# Altium project SC2.0.PrjPCB
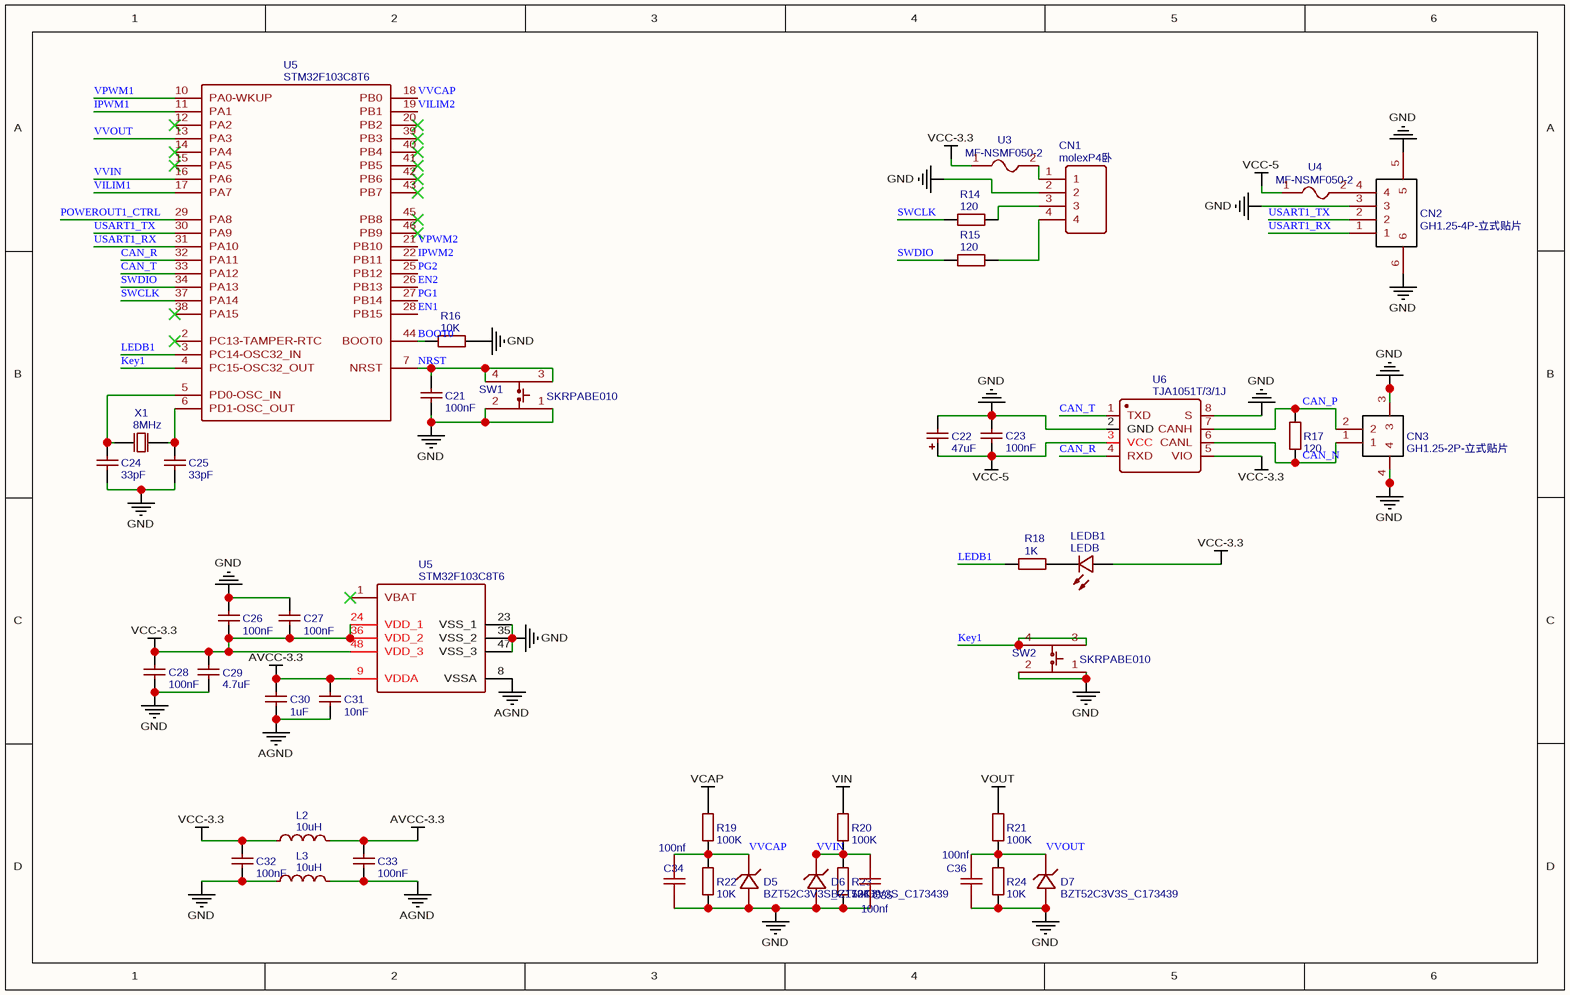
[diagram p0: MCU copy.SchDoc]
4 sheets, 184 parts. Net scope: flat (ports and power ports of the same name join across sheets).
Board file: SCapacitor2.0_2020-03-19_00-03-24.pcbdoc
Sheets:
  MCU copy.SchDoc
  power copy.SchDoc
  Switch1 copy.SchDoc
  Switch2 copy.SchDoc

## Sheet MCU copy.SchDoc
size 293 x 185 mm

### Parts
(Parts that share a designator on the sheet are numbered #1, #2 ... from top to bottom, then left to right.)
C21  100nF  [C0603]
C22  47uF  [CASE-A_3216]
C23  100nF  [R0603]
C24  33pF  [C0603]
C25  33pF  [C0603]
C26  100nF  [C0603]
C27  100nF  [C0603]
C28  100nF  [C0603]
C29  4.7uF  [C0603]
C30  1uF  [C0603]
C31  10nF  [C0603]
C32  100nF  [C0603]
C33  100nF  [C0603]
C34  100nf  [C0603]
C35  100nf  [C0603]
C36  100nf  [C0603]
CN1  molexP4卧  [SMD-10.15X4.8-4P]
CN2  GH1.25-4P-立式贴片  [SMD-1.25MM-4P-JST-H4.05]
CN3  GH1.25-2P-立式贴片  [SMD-1.25MM-2P-JST-H4.05]
D5  BZT52C3V3S_C173439  [SOD-323_L1.8-W1.3-LS2.5-RD]
D6  BZT52C3V3S_C173439  [SOD-323_L1.8-W1.3-LS2.5-RD]
D7  BZT52C3V3S_C173439  [SOD-323_L1.8-W1.3-LS2.5-RD]
L2  10uH  [L0603]
L3  10uH  [L0603]
LEDB1  LEDB  [LED-0603]
R14  120  [R0402]
R15  120  [R0402]
R16  10K  [R0402]
R17  120  [R0402]
R18  1K  [R0603]
R19  100K  [R0402]
R20  100K  [R0402]
R21  100K  [R0402]
R22  10K  [R0402]
R23  10K  [R0402]
R24  10K  [R0402]
SW1  SKRPABE010  [KEY-SMD-4P_L4.2-W3.2-H2.5]
SW2  SKRPABE010  [KEY-SMD-4P_L4.2-W3.2-H2.5]
U3  MF-NSMF050-2  [FUSE-1206]
U4  MF-NSMF050-2  [FUSE-1206]
U5#1  STM32F103C8T6  [LQFP-48_7X7X05P]
U5#2  STM32F103C8T6  [LQFP-48_7X7X05P]
U6  TJA1051T/3/1J  [SOIC-8_150MIL]
X1  8MHz  [SMD-5032_2P]

### Nets
AGND: C21.1 C22.2 C23.2 C24.1 C25.1 C26.1 C27.2 C28.1 C29.1 C30.1 C31.1 C32.1 C33.1 C34.1 C35.1 C36.1 CN1.2 CN2.3 CN2.5 CN2.6 CN3.3 CN3.4 D5.2 D6.2 D7.2 L3.1 L3.2 R16.1 R22.1 R23.1 R24.1 SW1.1 SW1.2 SW2.1 SW2.2 U5#2.8(VSSA) U5#2.23(VSS_1) U5#2.35(VSS_2) U5#2.47(VSS_3) U6.2(GND) U6.8(S)  [also labelled GND]
AVCC-3.3: C30.2 C31.2 C33.2 L2.2 U5#2.9(VDDA)
VCAP: R19.2
VCC-3.3: C26.2 C27.1 C28.2 C29.2 C32.2 L2.1 LEDB1.1(A) U3.1 U5#2.24(VDD_1) U5#2.36(VDD_2) U5#2.48(VDD_3) U6.5(VIO)
VCC-5: C22.1 C23.1 U4.1 U6.3(VCC)
VIN: R20.2
VOUT: R21.2
BOOT0: R16.2 U5#1.44(BOOT0)
CAN_N: CN3.1 R17.2 U6.6(CANL)
CAN_P: CN3.2 R17.1 U6.7(CANH)
CAN_R: U5#1.32(PA11) U6.4(RXD)
CAN_T: U5#1.33(PA12) U6.1(TXD)
EN1: U5#1.28(PB15)
EN2: U5#1.26(PB13)
IPWM1: U5#1.11(PA1)
IPWM2: U5#1.22(PB11)
Key1: SW2.3 SW2.4 U5#1.4(PC15-OSC32_OUT)
LEDB1: R18.1 U5#1.3(PC14-OSC32_IN)
NRST: C21.2 SW1.3 SW1.4 U5#1.7(NRST)
PG1: U5#1.27(PB14)
PG2: U5#1.25(PB12)
POWEROUT1_CTRL: U5#1.29(PA8)
SWCLK: R14.2 U5#1.37(PA14)
SWDIO: R15.2 U5#1.34(PA13)
USART1_RX: CN2.1 U5#1.31(PA10)
USART1_TX: CN2.2 U5#1.30(PA9)
VILIM1: U5#1.17(PA7)
VILIM2: U5#1.19(PB1)
VPWM1: U5#1.10(PA0-WKUP)
VPWM2: U5#1.21(PB10)
VVCAP: C34.2 D5.1 R19.1 R22.2 U5#1.18(PB0)
VVIN: C35.2 D6.1 R20.1 R23.2 U5#1.16(PA6)
VVOUT: C36.2 D7.1 R21.1 R24.2 U5#1.13(PA3)
NetC24_2: C24.2 U5#1.5(PD0-OSC_IN) X1.1(OSC1)
NetC25_2: C25.2 U5#1.6(PD1-OSC_OUT) X1.2(OSC2)
NetCN1_1: CN1.1 U3.2
NetCN1_3: CN1.3 R14.1
NetCN1_4: CN1.4 R15.1
NetCN2_4: CN2.4 U4.2
NetLEDB1_2: LEDB1.2(C) R18.2

Not connected (* = marked no-connect by the designer): U5#1 2(PC13-TAMPER-RTC)* 12(PA2)* 14(PA4)* 15(PA5)* 20(PB2)* 38(PA15)* 39(PB3)* 40(PB4)* 41(PB5)* 42(PB6)* 43(PB7)* 45(PB8)* 46(PB9)*; U5#2 1(VBAT)*

### Library data of the parts
C21 C23 C26-C28 C32 C33 = 100nF: BOM_Manufacturer Part: CL05B104KO5NNNC; BOM_Manufacturer: SAMSUNG; nameAlias: Capacitance; BOM_Supplier: LCSC; BOM_LCSC Assembly: Yes; BOM_Supplier Part: C1525; spicePre: C; spiceSymbolName: CL05B104KO5NNNC
C22 = 47uF: BOM_Manufacturer: Xiangyee; BOM_Manufacturer Part: CA45-A010K476T; nameAlias: Capacitance; Contributor: LCSC; BOM_Supplier: LCSC; BOM_Supplier Part: C127069; BOM_LCSC Assembly: Yes; spicePre: C; spiceSymbolName: CA45-A010K476T
C24 C25 = 33pF: BOM_Manufacturer Part: CL05C330JB5NNNC; BOM_Manufacturer: SAMSUNG; nameAlias: Capacitance; BOM_Supplier: LCSC; BOM_Supplier Part: C70465; spicePre: C; spiceSymbolName: CL05C330JB5NNNC
C29 = 4.7uF: BOM_Manufacturer Part: CL10A475KO8NNNC; BOM_Manufacturer: SAMSUNG; nameAlias: Capacitance; SMT Type: Basic; BOM_Supplier: LCSC; BOM_LCSC Assembly: Yes; BOM_Supplier Part: C19666; spicePre: C; spiceSymbolName: CL10A475KO8NNNC
C30 = 1uF: BOM_Manufacturer Part: CL10A105KB8NNNC; BOM_Manufacturer: SAMSUNG; nameAlias: Capacitance; BOM_Supplier: LCSC; BOM_LCSC Assembly: Yes; BOM_Supplier Part: C15849; spicePre: C; spiceSymbolName: CL10A105KB8NNNC
C31 = 10nF: BOM_Manufacturer Part: CL05B103KB5NNNC; BOM_Manufacturer: SAMSUNG; nameAlias: Capacitance; BOM_Supplier: LCSC; BOM_LCSC Assembly: Yes; BOM_Supplier Part: C15195; spicePre: C; spiceSymbolName: CL05B103KB5NNNC
C34-C36 = 100nf: nameAlias: Value(F); spicePre: C; spiceSymbolName: Cap_0402_US
CN1 = molexP4卧: BOM_Manufacturer: MOLEX; BOM_Manufacturer Part: 532610471; BOM_Supplier: LCSC; BOM_Supplier Part: C127368; spicePre: C
CN2 = GH1.25-4P-立式贴片: BOM_Manufacturer: JST Sales America; BOM_Manufacturer Part: BM04B-GHS-TBT(LF)(SN); Contributor: LCSC; BOM_Supplier: LCSC; BOM_Supplier Part: C161692; spicePre: C
CN3 = GH1.25-2P-立式贴片: BOM_Manufacturer: JST Sales America; BOM_Manufacturer Part: BM02B-GHS-TBT (LF)(SN); Contributor: LCSC; BOM_Supplier: LCSC; BOM_Supplier Part: C161690; spicePre: C
D5-D7 = BZT52C3V3S_C173439: BOM_Manufacturer: (MDD) Jiangsu Yutai Elec; Contributor: LCSC; SMT Type: Extend; BOM_Supplier: LCSC; BOM_Supplier Part: C173439; BOM_Manufacturer Part: BZT52C3V3S; BOM_LCSC Assembly: Yes; spicePre: D; spiceSymbolName: BZT52C3V3S_C173439
L2 L3 = 10uH: BOM_Manufacturer: Sunlord; BOM_Manufacturer Part: SDFL2012S100KTF; nameAlias: Inductance; SMT Type: Basic; BOM_Supplier: LCSC; BOM_LCSC Assembly: Yes; BOM_Supplier Part: C1046; spicePre: L; spiceSymbolName: SDFL2012S100KTF
LEDB1 = LEDB: BOM_Manufacturer: EVERLIGHT; BOM_Supplier: LCSC; BOM_LCSC Assembly: Yes; BOM_Supplier Part: C72041; spicePre: L
R14 R15 R17 = 120: BOM_Manufacturer: UniOhm; BOM_Manufacturer Part: 0402WGF1200TCE; nameAlias: Resistance (Ohms); BOM_Supplier: LCSC; BOM_LCSC Assembly: Yes; BOM_Supplier Part: C25079; spicePre: R; spiceSymbolName: 0402WGF1200TCE
R16 R22-R24 = 10K: BOM_Manufacturer: UniOhm; BOM_Manufacturer Part: 0402WGF1002TCE; nameAlias: Resistance (Ohms); SMT Type: Basic; BOM_Supplier: LCSC; BOM_LCSC Assembly: Yes; BOM_Supplier Part: C25744; spicePre: R; spiceSymbolName: 0402WGF1002TCE
R18 = 1K: BOM_Manufacturer: UniOhm; BOM_Manufacturer Part: 0402WGF1001TCE; nameAlias: Resistance (Ohms); SMT Type: Basic; BOM_Supplier: LCSC; BOM_LCSC Assembly: Yes; BOM_Supplier Part: C11702; spicePre: R; spiceSymbolName: 0402WGF1001TCE
R19-R21 = 100K: BOM_Manufacturer: UniOhm; BOM_Manufacturer Part: 0402WGF1003TCE; nameAlias: Resistance (Ohms); SMT Type: Basic; BOM_Supplier: LCSC; BOM_LCSC Assembly: Yes; BOM_Supplier Part: C25741; spicePre: R; spiceSymbolName: 0402WGF1003TCE
SW1 SW2 = SKRPABE010: BOM_Manufacturer: ALPS; BOM_Supplier: LCSC; BOM_Manufacturer Part: SKRPABE010; BOM_Supplier Part: C115360; spicePre: S
U3 U4 = MF-NSMF050-2: BOM_Manufacturer: BOURNS; BOM_Supplier: LCSC; BOM_Manufacturer Part: MF-NSMF050-2; BOM_Supplier Part: C75464; BOM_LCSC Assembly: Yes; spicePre: U
U5#1 U5#2 = STM32F103C8T6: BOM_Manufacturer: ST; subpart_no: 1; tags: STM32; timeStamp: 1455028086; BOM_Supplier Part: C8734; BOM_Supplier: LCSC; BOM_Manufacturer Part: STM32F103C8T6; image: http://image.lceda.cn/szlcsc/C8734.jpg; spicePre: U
U6 = TJA1051T/3/1J: BOM_Manufacturer: NXP; BOM_Supplier: LCSC; BOM_Manufacturer Part: TJA1051T/3/1J; BOM_LCSC Assembly: Yes; image: //image.lceda.cn/szlcsc/C38695.jpg; BOM_Supplier Part: C38695; spicePre: U
X1 = 8MHz: BOM_Manufacturer: Yangxing Tech; BOM_Manufacturer Part: X50328MSD2GC; nameAlias: Frequency; Contributor: LCSC; BOM_Supplier: LCSC; BOM_Supplier Part: C172361; BOM_LCSC Assembly: Yes; spicePre: X; spiceSymbolName: X50328MSD2GC_C172361

## Sheet power copy.SchDoc
size 260 x 185 mm
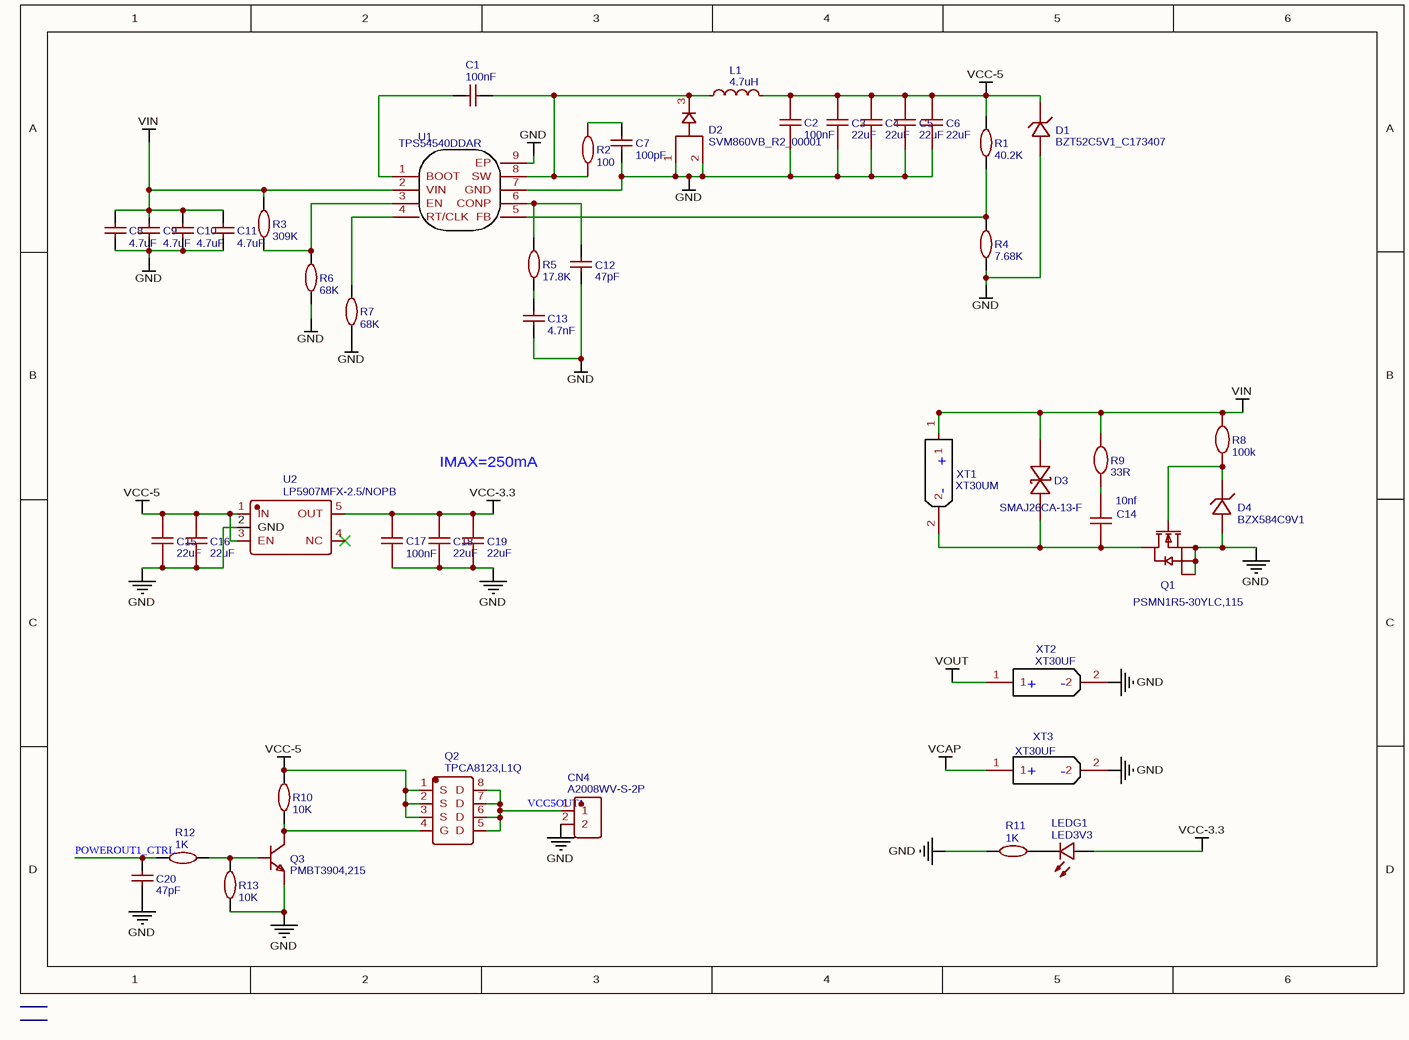
[diagram p1: power copy.SchDoc]

### Parts
C1  100nF  [C0603]
C2  100nF  [C0603]
C3  22uF  [C0603]
C4  22uF  [C0603]
C5  22uF  [C0603]
C6  22uF  [C0603]
C7  100pF  [C0603]
C8  4.7uF  [C0805]
C9  4.7uF  [C0805]
C10  4.7uF  [C0805]
C11  4.7uF  [C0805]
C12  47pF  [C0402]
C13  4.7nF  [C0402]
C14  10nf  [C0603]
C15  22uF  [C0603]
C16  22uF  [C0603]
C17  100nF  [C0402]
C18  22uF  [C0603]
C19  22uF  [C0603]
C20  47pF  [C0402]
CN4  A2008WV-S-2P  [CONN-SMD_A2008WV-S-2P]
D1  BZT52C5V1_C173407  [SOD-123_L2.7-W1.6-LS3.7-RD]
D2  SVM860VB_R2_00001  [TO-277B_3P-L6.1-W4.3-LS7.0-BR]
D3  SMAJ26CA-13-F  [SMA_L4.4-W2.6-LS5.0-BI]
D4  BZX584C9V1  [SOD-523F_L1.7-W0.9-LS1.7-RD]
L1  4.7uH  [IND-SMD_L6.0-W6.0]
LEDG1  LED3V3  [LED-0603]
Q1  PSMN1R5-30YLC,115  [SOT-669_L4.9-W4.0-P1.27-LS6.0-BR]
Q2  TPCA8123,L1Q  [POWERVDFN-8_L6.0-W5.0-P1.27-BL]
Q3  PMBT3904,215  [SOT-23_L2.9-W1.3-P0.95-LS2.4-BR]
R1  40.2K  [R0603]
R2  100  [R0402]
R3  309K  [R0603]
R4  7.68K  [R0402]
R5  17.8K  [R0603]
R6  68K  [R0603]
R7  68K  [R0603]
R8  100k  [R0603]
R9  33R  [R0603]
R10  10K  [R0402]
R11  1K  [R0603]
R12  1K  [R0402]
R13  10K  [R0402]
U1  TPS54540DDAR  [SOIC-8_L4.9-W3.9-P1.27-LS6.0-BL-EP]
U2  LP5907MFX-2.5/NOPB  [SOT-23-5_L3.0-W1.7-P0.95-LS2.8-BL]
XT1  XT30UM  [CONN-TH_XT30UPB-F]
XT2  XT30UF  [CONN-TH_XT30UPB-F]
XT3  XT30UF  [CONN-TH_XT30UPB-F]

### Nets
GND: C2.1 C3.1 C4.1 C5.1 C6.1 C7.2 C8.1 C9.1 C10.1 C11.1 C12.1 C13.1 C15.1 C16.1 C17.1 C18.1 C19.1 C20.1 CN4.2 D1.2(A) D2.1 D2.2 D4.2(A) Q1.1(S) Q1.2(S) Q1.3(S) Q3.2 R4.1 R6.1 R7.1 R11.1 R13.1 U1.7(GND) U1.9(EP) U2.2(GND) XT2.2 XT3.2  [project net AGND]
VCAP: XT3.1
VCC-3.3: C17.2 C18.2 C19.2 LEDG1.1(A) U2.5(OUT)
VCC-5: C2.2 C3.2 C4.2 C5.2 C6.2 C15.2 C16.2 D1.1(C) L1.2 Q2.1(S) Q2.2(S) Q2.3(S) R1.2 R10.2 U2.1(IN) U2.3(EN)
VIN: C8.2 C9.2 C10.2 C11.2 D3.2 R3.2 R8.2 R9.2 U1.2(VIN) XT1.1
VOUT: XT2.1
POWEROUT1_CTRL: C20.2 R12.1
VCC5OUT1: CN4.1 Q2.5(D) Q2.6(D) Q2.7(D) Q2.8(D)
NetC1_1: C1.1 U1.1(BOOT)
NetC1_2: C1.2 D2.3 L1.1 R2.1 U1.8(SW)
NetC7_1: C7.1 R2.2
NetC12_2: C12.2 R5.2 U1.6(CONP)
NetC13_2: C13.2 R5.1
NetC14_1: C14.1 D3.1 Q1.5(D) XT1.2
NetC14_2: C14.2 R9.1
NetD4_1: D4.1(K) Q1.4(G) R8.1
NetLEDG1_2: LEDG1.2(C) R11.2
NetQ2_4: Q2.4(G) Q3.3 R10.1
NetQ3_1: Q3.1 R12.2 R13.2
NetR1_1: R1.1 R4.2 U1.5(FB)
NetR3_1: R3.1 R6.2 U1.3(EN)
NetR7_2: R7.2 U1.4(RT/CLK)

Not connected (* = marked no-connect by the designer): U2 4(NC)*

### Notes on the sheet
- IMAX=250mA
- (in symbol XT30UF) +; -
- (in symbol XT30UM) +; -

### Library data of the parts
C1 = 100nF: as C21 on sheet MCU copy; BOM_Supplier: LCSC; BOM_LCSC Assembly: Yes; BOM_Supplier Part: C1525; spicePre: C; spiceSymbolName: CL05B104KO5NNNC
C2 = 100nF: BOM_Manufacturer: YAGEO; BOM_Manufacturer Part: AC0603KRX7R0BB104; nameAlias: Capacitance; Contributor: LCSC; BOM_Supplier: LCSC; BOM_Supplier Part: C408909; spicePre: C; spiceSymbolName: AC0603KRX7R0BB104
C3-C6 C15 C16 C18 C19 = 22uF: BOM_Manufacturer: SAMSUNG; BOM_Manufacturer Part: CL10A226MQ8NRNC; nameAlias: Capacitance; SMT Type: Basic; BOM_Supplier: LCSC; BOM_LCSC Assembly: Yes; BOM_Supplier Part: C59461; spicePre: C; spiceSymbolName: CL10A226MQ8NRNC
C7 = 100pF: BOM_Manufacturer Part: CGA3E2C0G1H101JT0Y0N; BOM_Manufacturer: TDK; nameAlias: Capacitance; BOM_Supplier: LCSC; BOM_Supplier Part: C76709; spicePre: C; spiceSymbolName: CGA3E2C0G1H101JT0Y0N
C8-C11 = 4.7uF: BOM_Manufacturer: SAMSUNG; BOM_Manufacturer Part: CL21A475KBQNNNE; nameAlias: Capacitance; BOM_Supplier: LCSC; BOM_Supplier Part: C98192; spicePre: C; spiceSymbolName: CL21A475KBQNNNE
C12 C20 = 47pF: BOM_Manufacturer: FH; BOM_Manufacturer Part: 0402CG470J500NT; nameAlias: Capacitance; SMT Type: Basic; BOM_Supplier: LCSC; BOM_LCSC Assembly: Yes; BOM_Supplier Part: C1567; spicePre: C; spiceSymbolName: 0402CG470J500NT
C13 = 4.7nF: BOM_Manufacturer: FH; BOM_Manufacturer Part: 0402B472K500NT; nameAlias: Capacitance; SMT Type: Basic; BOM_Supplier: LCSC; BOM_LCSC Assembly: Yes; BOM_Supplier Part: C1538; spicePre: C; spiceSymbolName: 0402B472K500NT
C14 = 10nf: nameAlias: Value(F); spicePre: C; spiceSymbolName: Cap_0402_US
C17 = 100nF: BOM_Manufacturer: MuRata; BOM_Manufacturer Part: GRM188R71H104KA93D; nameAlias: Capacitance; BOM_Supplier: LCSC; BOM_Supplier Part: C77055; spicePre: C; spiceSymbolName: GRM188R71H104KA93D
CN4 = A2008WV-S-2P: BOM_Manufacturer: Changjiang Connectors; Contributor: LCSC; BOM_Supplier: LCSC; BOM_Supplier Part: C273123; BOM_Manufacturer Part: A2008WV-S-2P; spicePre: C; spiceSymbolName: A2008WV-S-2P
D1 = BZT52C5V1_C173407: BOM_Manufacturer: (MDD) Jiangsu Yutai Elec; Contributor: LCSC; SMT Type: Extend; BOM_Supplier: LCSC; BOM_Supplier Part: C173407; BOM_Manufacturer Part: BZT52C5V1; BOM_LCSC Assembly: Yes; spicePre: D; spiceSymbolName: BZT52C5V1_C173407
D2 = SVM860VB_R2_00001: BOM_Manufacturer: PANJIT International; Contributor: LCSC; BOM_Supplier: LCSC; BOM_Supplier Part: C391734; BOM_Manufacturer Part: SVM860VB_R2_00001; spicePre: D; spiceSymbolName: SVM860VB_R2_00001
D3 = SMAJ26CA-13-F: BOM_Manufacturer: DIODES; Contributor: LCSC; SMT Type: Extend; BOM_Supplier: LCSC; BOM_Manufacturer Part: SMAJ26CA-13-F; BOM_Supplier Part: C134976; BOM_LCSC Assembly: Yes; spicePre: D; spiceSymbolName: SMAJ26CA-13-F
D4 = BZX584C9V1: SMT Type: Extend; BOM_Supplier: LCSC; BOM_LCSC Assembly: Yes; spicePre: D; spiceSymbolName: BZX584C12-V-G-08
L1 = 4.7uH: BOM_Manufacturer: ShunXiang Connaught Elec; BOM_Manufacturer Part: SMNR6028-4R7MT; nameAlias: Inductance; Contributor: LCSC; BOM_Supplier: LCSC; BOM_Supplier Part: C266428; spicePre: L; spiceSymbolName: SMNR6028-4R7MT
LEDG1 = LED3V3: BOM_Manufacturer: EVERLIGHT; BOM_Manufacturer Part: 19-217/GHC-YR1S2/3T; BOM_Supplier: LCSC; BOM_LCSC Assembly: Yes; image: //image.lceda.cn/szlcsc/C72043.jpg; BOM_Supplier Part: C72043; spicePre: L
Q1 = PSMN1R5-30YLC,115: BOM_Manufacturer: Nexperia; Contributor: LCSC; BOM_Supplier: LCSC; BOM_Supplier Part: C427523; BOM_Manufacturer Part: PSMN1R5-30YLC,115; spicePre: Q; spiceSymbolName: PSMN1R5-30YLC,115
Q2 = TPCA8123,L1Q: BOM_Manufacturer: TOSHIBA; Contributor: LCSC; SMT Type: Extend; BOM_Supplier: LCSC; BOM_Supplier Part: C180399; BOM_Manufacturer Part: TPCA8123,L1Q; BOM_LCSC Assembly: Yes; spicePre: Q; spiceSymbolName: TPCA8123,L1Q
Q3 = PMBT3904,215: BOM_Manufacturer: Nexperia; SMT Type: Extend; BOM_Supplier: LCSC; BOM_Manufacturer Part: PMBT3904,215; image: //image.lceda.cn/szlcsc/C8667.jpg; BOM_Supplier Part: C8667; BOM_LCSC Assembly: Yes; spicePre: Q; spiceSymbolName: PMBT3904,215
R1 = 40.2K: BOM_Manufacturer: UniOhm; BOM_Manufacturer Part: 0603WAF4022T5E; nameAlias: Resistance (Ohms); SMT Type: Basic; BOM_Supplier: LCSC; BOM_LCSC Assembly: Yes; BOM_Supplier Part: C12447; spicePre: R; spiceSymbolName: 0603WAF4022T5E
R2 = 100: BOM_Manufacturer: YAGEO; BOM_Manufacturer Part: AC0402FR-07100RL; nameAlias: Resistance (Ohms); Contributor: LCSC; BOM_Supplier: LCSC; BOM_Supplier Part: C144808; spicePre: R; spiceSymbolName: AC0402FR-07100RL
R3 = 309K: BOM_Manufacturer: UniOhm; BOM_Manufacturer Part: 0603WAF3093T5E; nameAlias: Resistance (Ohms); SMT Type: Extend; BOM_Supplier: LCSC; BOM_Supplier Part: C23001; BOM_LCSC Assembly: Yes; spicePre: R; spiceSymbolName: 0603WAF3093T5E
R4 = 7.68K: BOM_Manufacturer: UniOhm; BOM_Manufacturer Part: 0402WGF7681TCE; nameAlias: Resistance (Ohms); SMT Type: Extend; BOM_Supplier: LCSC; BOM_Supplier Part: C25919; BOM_LCSC Assembly: Yes; spicePre: R; spiceSymbolName: 0402WGF7681TCE
R5 = 17.8K: BOM_Manufacturer: UniOhm; BOM_Manufacturer Part: 0603WAF1782T5E; nameAlias: Resistance (Ohms); SMT Type: Extend; BOM_Supplier: LCSC; BOM_Supplier Part: C22821; BOM_LCSC Assembly: Yes; spicePre: R; spiceSymbolName: 0603WAF1782T5E
R6 R7 = 68K: BOM_Manufacturer: UniOhm; BOM_Manufacturer Part: 0603WAF6802T5E; nameAlias: Resistance (Ohms); SMT Type: Basic; BOM_Supplier: LCSC; BOM_LCSC Assembly: Yes; BOM_Supplier Part: C23231; spicePre: R; spiceSymbolName: 0603WAF6802T5E
R8 = 100k: nameAlias: Value(Ω); spicePre: R; spiceSymbolName: Res_AXIAL-0.3(1/8W)_EU
R9 = 33R: nameAlias: Value(Ω); spicePre: R; spiceSymbolName: Res_AXIAL-0.3(1/8W)_EU
R10 R13 = 10K: as R16 on sheet MCU copy; BOM_Supplier: LCSC; BOM_LCSC Assembly: Yes; BOM_Supplier Part: C25744; spicePre: R; spiceSymbolName: 0402WGF1002TCE
R11 R12 = 1K: as R18 on sheet MCU copy; BOM_Supplier: LCSC; BOM_LCSC Assembly: Yes; BOM_Supplier Part: C11702; spicePre: R; spiceSymbolName: 0402WGF1001TCE
U1 = TPS54540DDAR: BOM_Manufacturer: TI; SMT Type: Extend; BOM_Supplier: LCSC; BOM_Manufacturer Part: TPS54540DDAR; BOM_Supplier Part: C95286; BOM_LCSC Assembly: Yes; spicePre: U; spiceSymbolName: TPS54540DDAR
U2 = LP5907MFX-2.5/NOPB: BOM_Manufacturer: TI; Contributor: LCSC; SMT Type: Extend; BOM_Supplier: LCSC; BOM_Manufacturer Part: LP5907MFX-2.5/NOPB; BOM_Supplier Part: C165132; BOM_LCSC Assembly: Yes; spicePre: U; spiceSymbolName: LP5907MFX-2.5/NOPB
XT1 = XT30UM: BOM_Manufacturer Part: XT60; Contributor: 4bucks; Package Display: No; spicePre: X
XT2 XT3 = XT30UF: BOM_Manufacturer Part: XT60; Contributor: 4bucks; Package Display: No; spicePre: X

## Sheet Switch1 copy.SchDoc
size 299 x 312 mm
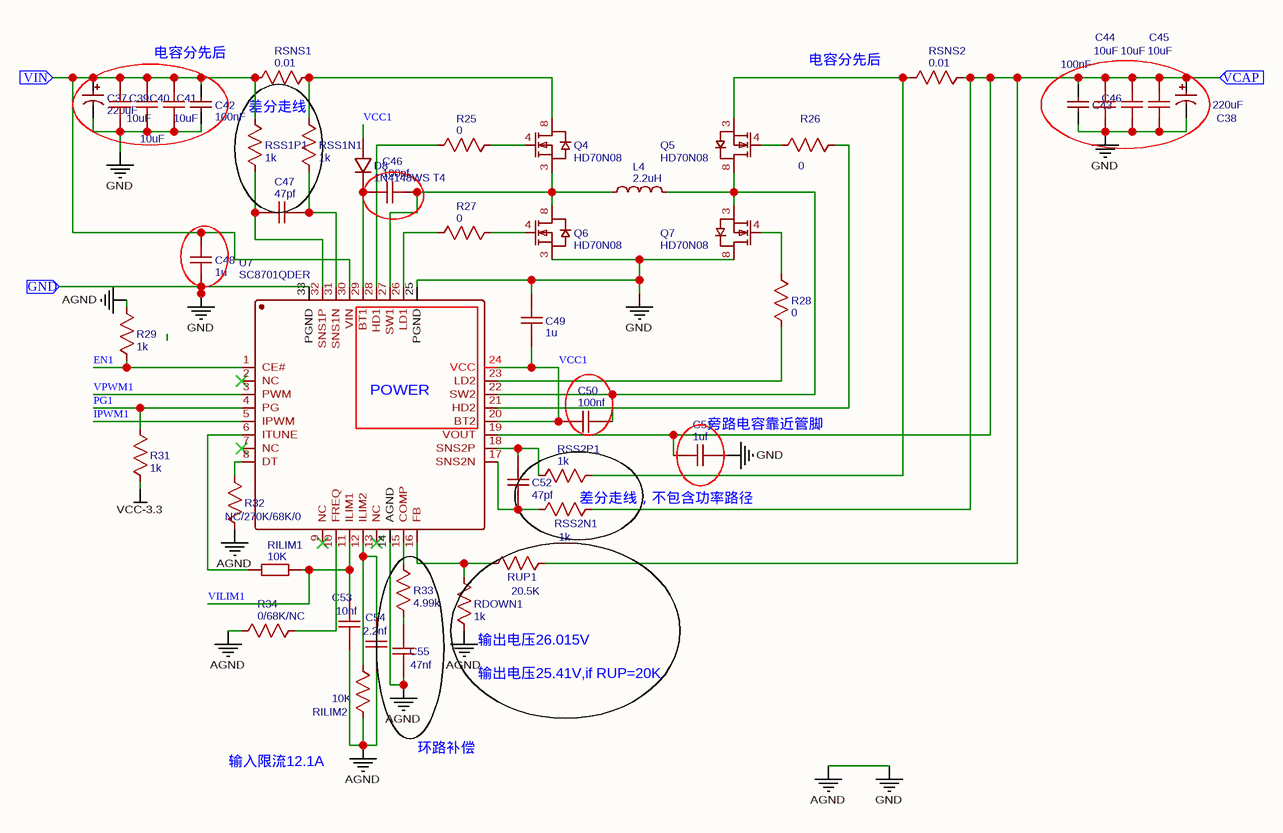
[diagram p2: Switch1 copy.SchDoc]

### Parts
C37  220uF  [CAP-SMD_BD10.0-L10.3-W10.3-FD]
C38  220uF  [CAP-SMD_BD10.0-L10.3-W10.3-FD]
C39  10uF  [C1206]
C40  10uF  [C1206]
C41  10uF  [C1206]
C42  100nF  [C0603]
C43  100nF  [C0603]
C44  10uF  [C1206]
C45  10uF  [C1206]
C46  100nf  [C0402]
C47  47pf  [C0402]
C48  1u  [C0402]
C49  1u  [C0402]
C50  100nf  [C0402]
C51  1uf  [C0402]
C52  47pf  [C0402]
C53  10nf  [C0402]
C54  2.2nf  [C0402]
C55  47nf  [C0402]
D8  1N4148WS T4  [SOD-323_L1.8-W1.3-LS2.5-FD]
L4  2.2uH  [IND-SMD_L17.5-W17.0_YXMAC1770]
NO1  10uF  [C1206]
Q4  HD70N08  [PDFN-8_L4.9-W5.8-P1.27-LS6.1-BL FOR3]
Q5  HD70N08  [PDFN-8_L4.9-W5.8-P1.27-LS6.1-BL FOR3]
Q6  HD70N08  [PDFN-8_L4.9-W5.8-P1.27-LS6.1-BL FOR3]
Q7  HD70N08  [PDFN-8_L4.9-W5.8-P1.27-LS6.1-BL FOR3]
R25  0  [R0603]
R26  0  [R0603]
R27  0  [R0603]
R28  0  [R0603]
R29  1k  [R0402]
R31  1k  [R0402]
R32  NC/270K/68K/0  [R0402]
R33  4.99k  [R0402]
R34  0/68K/NC  [R0402]
RDOWN1  1k  [R0402]
RILIM1  10K  [R0402]
RILIM2  10K  [R0402]
RSNS1  0.01  [R0805]
RSNS2  0.01  [R0805]
RSS1N1  1k  [R0402]
RSS1P1  1k  [R0402]
RSS2N1  1k  [R0402]
RSS2P1  1k  [R0402]
RUP1  20.5K  [R0402]
U7  SC8701QDER  [QFN-32_L4.0-W4.0-P0.4-BL-EP2.6]

### Blocks framed on the sheet
POWER: U7

### Ports
GND (in), VCAP (in), VIN (in)

### Nets
AGND: C37.2 C38.2 C39.1 C40.1 C41.1 C42.1 C43.1 C44.1 C45.1 C48.1 C49.2 C51.1 C53.1 C54.1 C55.1 NO1.1 Q6.3(S) Q7.8(D) R29.2 R32.1 R34.1 RDOWN1.1 RILIM2.1 U7.14(AGND) U7.25(PGND) U7.33(PGND) ; port GND  [also labelled GND]
VCC-3.3: R31.1
EN1: R29.1 U7.1(CE#)
IPWM1: U7.5(IPWM)
PG1: R31.2 U7.4(PG)
VCC1: C49.1 C50.2 D8.1(A) U7.20(BT2) U7.24(VCC)
VILIM1: C53.2 RILIM1.2 U7.11(ILIM1)
VPWM1: U7.3(PWM)
NetC37_1: C37.1 C39.2 C40.2 C41.2 C42.2 C48.2 RSNS1.1 RSS1P1.2 U7.30(VIN) ; port VIN
NetC38_1: C38.1 C43.2 C44.2 C45.2 C51.2 NO1.2 RSNS2.2 RSS2N1.2 RUP1.2 U7.19(VOUT) ; port VCAP
NetC46_1: C46.1 D8.2(K) U7.29(BT1)
NetC46_2: C46.2 L4.1 Q4.3(S) Q6.8(D) U7.27(SW1)
NetC47_1: C47.1 RSS1N1.1 U7.31(SNS1N)
NetC47_2: C47.2 RSS1P1.1 U7.32(SNS1P)
NetC50_1: C50.1 L4.2 Q5.8(D) Q7.3(S) U7.22(SW2)
NetC52_1: C52.1 RSS2P1.1 U7.18(SNS2P)
NetC52_2: C52.2 RSS2N1.1 U7.17(SNS2N)
NetC54_2: C54.2 RILIM2.2 U7.12(ILIM2)
NetC55_2: C55.2 R33.1
NetQ4_4: Q4.4(G) R25.2
NetQ4_8: Q4.8(D) RSNS1.2 RSS1N1.2
NetQ5_3: Q5.3(S) RSNS2.1 RSS2P1.2
NetQ5_4: Q5.4(G) R26.1
NetQ6_4: Q6.4(G) R27.2
NetQ7_4: Q7.4(G) R28.2
NetR25_1: R25.1 U7.28(HD1)
NetR26_2: R26.2 U7.21(HD2)
NetR27_1: R27.1 U7.26(LD1)
NetR28_1: R28.1 U7.23(LD2)
NetR32_2: R32.2 U7.8(DT)
NetR33_2: R33.2 U7.15(COMP)
NetR34_2: R34.2 U7.10(FREQ)
NetRDOWN1_2: RDOWN1.2 RUP1.1 U7.16(FB)
NetRILIM1_1: RILIM1.1 U7.6(ITUNE)

Not connected (* = marked no-connect by the designer): U7 2(NC)* 7(NC)* 9(NC)* 13(NC)*

### Notes on the sheet
- 电容分先后
- (near RSS1P1) 差分走线
- (near C44) C46
- (near C51) 旁路电容靠近管脚
- (near RSS2N1) 差分走线，不包含功率路径
- (near RDOWN1) 输出电压26.015V
- (near RDOWN1) 输出电压25.41V,if RUP=20K
- 输入限流12.1A
- 环路补偿

### Library data of the parts
C37 C38 = 220uF: BOM_Manufacturer: CapXon; BOM_Manufacturer Part: DV221M050G105A; nameAlias: Capacitance; BOM_Supplier: LCSC; BOM_Supplier Part: C65217; spicePre: C; spiceSymbolName: DV221M050G105A
C39-C41 C44 C45 NO1 = 10uF: BOM_Manufacturer: MuRata; BOM_Manufacturer Part: GRM31CR61H106KA12L; nameAlias: Capacitance; BOM_Supplier: LCSC; BOM_Supplier Part: C77092; spicePre: C; spiceSymbolName: GRM31CR61H106KA12L
C42 C43 = 100nF: BOM_Manufacturer Part: CL10B104JB8NNNC; BOM_Manufacturer: SAMSUNG; nameAlias: Capacitance; SMT Type: Extend; BOM_Supplier: LCSC; BOM_Supplier Part: C1525; BOM_LCSC Assembly: Yes; spicePre: C; spiceSymbolName: CL10B104JB8NNNC
C46 C50 = 100nf: nameAlias: Value(F); spicePre: C; spiceSymbolName: Cap_0402_US
C47 C52 = 47pf: nameAlias: Value(F); spicePre: C; spiceSymbolName: Cap_0402_US; BOM_Supplier Part: C1567
C48 C49 = 1u: nameAlias: Value(F); spicePre: C; spiceSymbolName: Cap_0402_US
C51 = 1uf: nameAlias: Value(F); spicePre: C; spiceSymbolName: Cap_0402_US
C53 = 10nf: nameAlias: Value(F); spicePre: C; spiceSymbolName: Cap_0402_US
C54 = 2.2nf: nameAlias: Value(F); spicePre: C; spiceSymbolName: Cap_0402_US
C55 = 47nf: nameAlias: Value(F); spicePre: C; spiceSymbolName: Cap_0402_US
D8 = 1N4148WS T4: BOM_Manufacturer: CJ; SMT Type: Basic; BOM_Supplier: LCSC; BOM_Manufacturer Part: 1N4148WS T4; BOM_LCSC Assembly: Yes; image: //image.lceda.cn/szlcsc/C2128.jpg; BOM_Supplier Part: C2128; spicePre: D; spiceSymbolName: 1N4148WS T4
L4 = 2.2uH: BOM_Manufacturer: YUXIN TECH; BOM_Manufacturer Part: YXMAC1770-2R2M-IGP; nameAlias: Inductance; Contributor: LCSC; BOM_Supplier: LCSC; BOM_Supplier Part: C241452; spicePre: L; spiceSymbolName: YXMAC1770-2R2M-IGP
Q4-Q7 = HD70N08: BOM_Manufacturer: HL; Contributor: LCSC; BOM_Supplier: LCSC; BOM_Manufacturer Part: HD70N08; spicePre: Q; spiceSymbolName: HD70N08
  Q4: BOM_Supplier Part: C190849
  Q5-Q7: BOM_Supplier Part: C216254
R25-R28 = 0: nameAlias: Value(Ω); spicePre: R; spiceSymbolName: Res_0402(1/16W)_US
R29 R31 RDOWN1 RSS1N1 RSS1P1 RSS2N1 RSS2P1 = 1k: nameAlias: Value(Ω); spicePre: R; spiceSymbolName: Res_0402(1/16W)_US
  RSS1N1 RSS1P1 RSS2N1 RSS2P1: BOM_Supplier Part: C319809
R32 = NC/270K/68K/0: nameAlias: Value(Ω); spicePre: R; spiceSymbolName: Res_0402(1/16W)_US
R33 = 4.99k: nameAlias: Value(Ω); spicePre: R; spiceSymbolName: Res_0402(1/16W)_US
R34 = 0/68K/NC: nameAlias: Value(Ω); spicePre: R; spiceSymbolName: Res_0402(1/16W)_US
RILIM1 = 10K: nameAlias: Resistance (Ohms); Contributor: LCSC; BOM_Supplier: LCSC; BOM_Supplier Part: C25744; BOM_LCSC Assembly: Yes; spicePre: R; spiceSymbolName: 0805WAD1002T5E
RILIM2 = 10K: nameAlias: Value(Ω); spicePre: R; spiceSymbolName: Res_0402(1/16W)_US
RSNS1 RSNS2 = 0.01: nameAlias: Value(Ω); spicePre: R; spiceSymbolName: Res_0402(1/16W)_US; BOM_Supplier Part: C236284
RUP1 = 20.5K: nameAlias: Value(Ω); spicePre: R; spiceSymbolName: Res_0402(1/16W)_US
U7 = SC8701QDER: BOM_Manufacturer: Southchip Semicon; Contributor: LCSC; SMT Type: Extend; BOM_Supplier: LCSC; BOM_Supplier Part: C252410; BOM_Manufacturer Part: SC8701QDER; BOM_LCSC Assembly: Yes; spicePre: U; spiceSymbolName: SC8701QDER

## Sheet Switch2 copy.SchDoc
size 299 x 308 mm
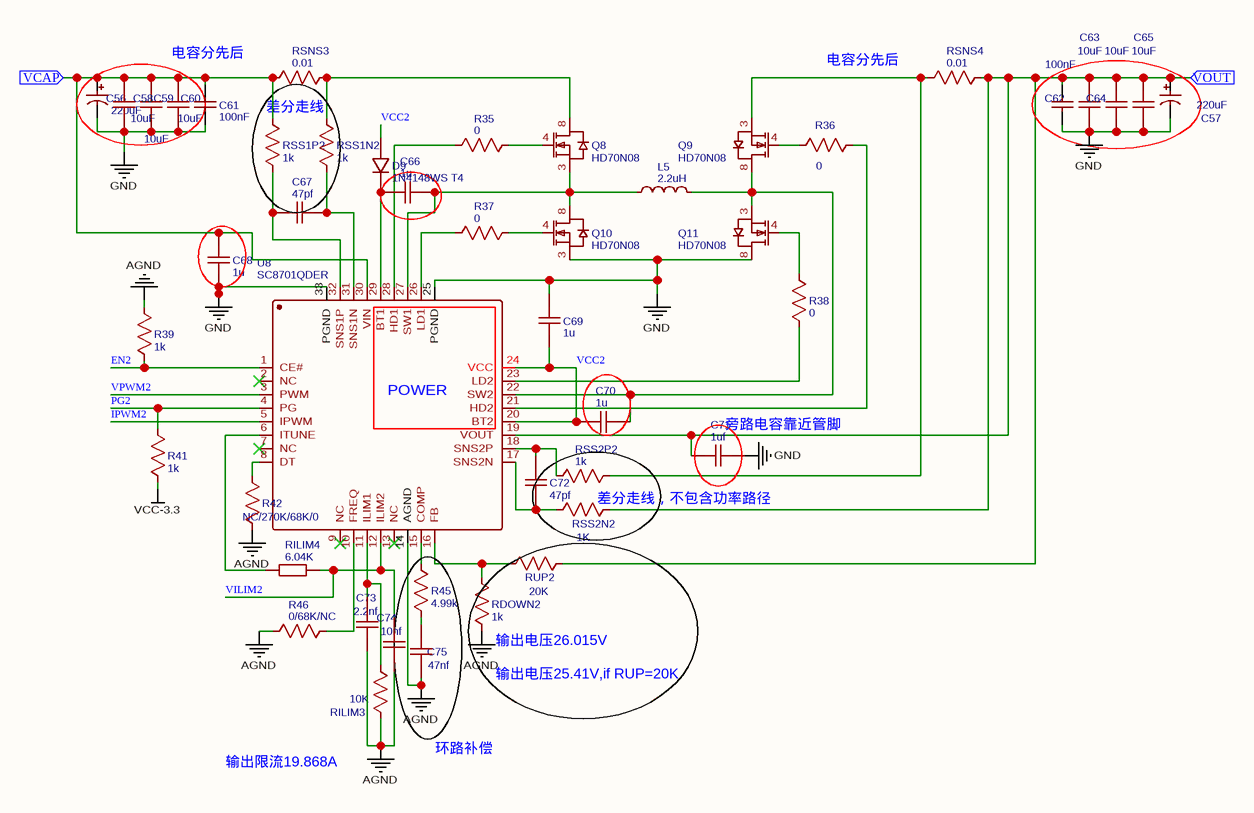
[diagram p3: Switch2 copy.SchDoc]

### Parts
C56  220uF  [CAP-SMD_BD10.0-L10.3-W10.3-FD]
C57  220uF  [CAP-SMD_BD10.0-L10.3-W10.3-FD]
C58  10uF  [C1206]
C59  10uF  [C1206]
C60  10uF  [C1206]
C61  100nF  [C0603]
C62  100nF  [C0603]
C63  10uF  [C1206]
C64  10uF  [C1206]
C65  10uF  [C1206]
C66  1u  [C0402]
C67  47pf  [C0402]
C68  1u  [C0402]
C69  1u  [C0402]
C70  1u  [C0402]
C71  1uf  [C0402]
C72  47pf  [C0402]
C73  2.2nf  [C0402]
C74  10nf  [C0402]
C75  47nf  [C0402]
D9  1N4148WS T4  [SOD-323_L1.8-W1.3-LS2.5-FD]
L5  2.2uH  [IND-SMD_L17.5-W17.0_YXMAC1770]
Q8  HD70N08  [PDFN-8_L4.9-W5.8-P1.27-LS6.1-BL FOR3]
Q9  HD70N08  [PDFN-8_L4.9-W5.8-P1.27-LS6.1-BL FOR3]
Q10  HD70N08  [PDFN-8_L4.9-W5.8-P1.27-LS6.1-BL FOR3]
Q11  HD70N08  [PDFN-8_L4.9-W5.8-P1.27-LS6.1-BL FOR3]
R35  0  [R0603]
R36  0  [R0603]
R37  0  [R0603]
R38  0  [R0603]
R39  1k  [R0402]
R41  1k  [R0402]
R42  NC/270K/68K/0  [R0402]
R45  4.99k  [R0402]
R46  0/68K/NC  [R0402]
RDOWN2  1k  [R0402]
RILIM3  10K  [R0402]
RILIM4  6.04K  [R0402]
RSNS3  0.01  [R0805]
RSNS4  0.01  [R0805]
RSS1N2  1k  [R0402]
RSS1P2  1k  [R0402]
RSS2N2  1K  [R0402]
RSS2P2  1k  [R0402]
RUP2  20K  [R0402]
U8  SC8701QDER  [QFN-32_L4.0-W4.0-P0.4-BL-EP2.6]

### Blocks framed on the sheet
POWER: U8

### Ports
VCAP (in), VOUT (in)

### Nets
AGND: C56.2 C57.2 C58.1 C59.1 C60.1 C61.1 C62.1 C63.1 C64.1 C65.1 C68.1 C69.2 C71.1 C73.1 C74.1 C75.1 Q10.3(S) Q11.8(D) R39.2 R42.1 R46.1 RDOWN2.1 RILIM3.1 U8.14(AGND) U8.25(PGND) U8.33(PGND)  [also labelled GND]
VCC-3.3: R41.1
EN2: R39.1 U8.1(CE#)
IPWM2: U8.5(IPWM)
PG2: R41.2 U8.4(PG)
VCC2: C69.1 C70.2 D9.1(A) U8.20(BT2) U8.24(VCC)
VILIM2: C74.2 RILIM4.2 U8.12(ILIM2)
VPWM2: U8.3(PWM)
NetC38_1: C56.1 C58.2 C59.2 C60.2 C61.2 C68.2 RSNS3.1 RSS1P2.2 U8.30(VIN) ; port VCAP
NetC57_1: C57.1 C62.2 C63.2 C64.2 C65.2 C71.2 RSNS4.2 RSS2N2.2 RUP2.2 U8.19(VOUT) ; port VOUT
NetC66_1: C66.1 D9.2(K) U8.29(BT1)
NetC66_2: C66.2 L5.1 Q8.3(S) Q10.8(D) U8.27(SW1)
NetC67_1: C67.1 RSS1N2.1 U8.31(SNS1N)
NetC67_2: C67.2 RSS1P2.1 U8.32(SNS1P)
NetC70_1: C70.1 L5.2 Q9.8(D) Q11.3(S) U8.22(SW2)
NetC72_1: C72.1 RSS2P2.1 U8.18(SNS2P)
NetC72_2: C72.2 RSS2N2.1 U8.17(SNS2N)
NetC73_2: C73.2 RILIM3.2 U8.11(ILIM1)
NetC75_2: C75.2 R45.1
NetQ8_4: Q8.4(G) R35.2
NetQ8_8: Q8.8(D) RSNS3.2 RSS1N2.2
NetQ9_3: Q9.3(S) RSNS4.1 RSS2P2.2
NetQ9_4: Q9.4(G) R36.1
NetQ10_4: Q10.4(G) R37.2
NetQ11_4: Q11.4(G) R38.2
NetR35_1: R35.1 U8.28(HD1)
NetR36_2: R36.2 U8.21(HD2)
NetR37_1: R37.1 U8.26(LD1)
NetR38_1: R38.1 U8.23(LD2)
NetR42_2: R42.2 U8.8(DT)
NetR45_2: R45.2 U8.15(COMP)
NetR46_2: R46.2 U8.10(FREQ)
NetRDOWN2_2: RDOWN2.2 RUP2.1 U8.16(FB)
NetRILIM4_1: RILIM4.1 U8.6(ITUNE)

Not connected (* = marked no-connect by the designer): U8 2(NC)* 7(NC)* 9(NC)* 13(NC)*

### Notes on the sheet
- 电容分先后
- (near RSS1P2) 差分走线
- (near C63) C64
- (near C71) 旁路电容靠近管脚
- (near RSS2N2) 差分走线，不包含功率路径
- (near RDOWN2) 输出电压26.015V
- (near RDOWN2) 输出电压25.41V,if RUP=20K
- 输出限流19.868A
- 环路补偿

### Library data of the parts
C56 C57 = 220uF: as C37 on sheet Switch1 copy; BOM_Supplier: LCSC; BOM_Supplier Part: C65217; spicePre: C; spiceSymbolName: DV221M050G105A
C58-C60 C63-C65 = 10uF: as C39 on sheet Switch1 copy; BOM_Supplier: LCSC; BOM_Supplier Part: C77092; spicePre: C; spiceSymbolName: GRM31CR61H106KA12L
C61 C62 = 100nF: as C42 on sheet Switch1 copy; BOM_Supplier: LCSC; BOM_Supplier Part: C1525; BOM_LCSC Assembly: Yes; spicePre: C; spiceSymbolName: CL10B104JB8NNNC
C66 C68-C70 = 1u: nameAlias: Value(F); spicePre: C; spiceSymbolName: Cap_0402_US
C67 C72 = 47pf: nameAlias: Value(F); spicePre: C; spiceSymbolName: Cap_0402_US
C71 = 1uf: nameAlias: Value(F); spicePre: C; spiceSymbolName: Cap_0402_US
C73 = 2.2nf: nameAlias: Value(F); spicePre: C; spiceSymbolName: Cap_0402_US
C74 = 10nf: nameAlias: Value(F); spicePre: C; spiceSymbolName: Cap_0402_US
C75 = 47nf: nameAlias: Value(F); spicePre: C; spiceSymbolName: Cap_0402_US
D9 = 1N4148WS T4: BOM_Manufacturer: CJ; SMT Type: Basic; BOM_Supplier: LCSC; BOM_Manufacturer Part: 1N4148WS T4; BOM_LCSC Assembly: Yes; image: //image.lceda.cn/szlcsc/C2128.jpg; BOM_Supplier Part: C2128; spicePre: D; spiceSymbolName: 1N4148WS T4
L5 = 2.2uH: as L4 on sheet Switch1 copy; BOM_Supplier: LCSC; BOM_Supplier Part: C241452; spicePre: L; spiceSymbolName: YXMAC1770-2R2M-IGP
Q8-Q11 = HD70N08: BOM_Manufacturer: HL; Contributor: LCSC; BOM_Supplier: LCSC; BOM_Supplier Part: C216254; BOM_Manufacturer Part: HD70N08; spicePre: Q; spiceSymbolName: HD70N08
R35-R38 = 0: nameAlias: Value(Ω); spicePre: R; spiceSymbolName: Res_0402(1/16W)_US
R39 R41 RDOWN2 RSS1N2 RSS1P2 RSS2P2 = 1k: nameAlias: Value(Ω); spicePre: R; spiceSymbolName: Res_0402(1/16W)_US
  RSS1N2 RSS1P2 RSS2P2: BOM_Supplier Part: C319809
R42 = NC/270K/68K/0: nameAlias: Value(Ω); spicePre: R; spiceSymbolName: Res_0402(1/16W)_US
R45 = 4.99k: nameAlias: Value(Ω); spicePre: R; spiceSymbolName: Res_0402(1/16W)_US
R46 = 0/68K/NC: nameAlias: Value(Ω); spicePre: R; spiceSymbolName: Res_0402(1/16W)_US
RILIM3 = 10K: nameAlias: Value(Ω); spicePre: R; spiceSymbolName: Res_0402(1/16W)_US
RILIM4 = 6.04K: BOM_Manufacturer: WTC; BOM_Manufacturer Part: WR04X6041FTL; nameAlias: Resistance (Ohms); Contributor: LCSC; BOM_Supplier: LCSC; BOM_Supplier Part: C168240; spicePre: R; spiceSymbolName: WR04X6041FTL
RSNS3 RSNS4 = 0.01: nameAlias: Value(Ω); spicePre: R; spiceSymbolName: Res_0402(1/16W)_US; BOM_Supplier Part: C236284
RSS2N2 = 1K: nameAlias: Value(Ω); spicePre: R; spiceSymbolName: Res_0402(1/16W)_US; BOM_Supplier Part: C319809
RUP2 = 20K: nameAlias: Value(Ω); spicePre: R; spiceSymbolName: Res_0402(1/16W)_US
U8 = SC8701QDER: as U7 on sheet Switch1 copy; BOM_Supplier: LCSC; BOM_Supplier Part: C252410; BOM_Manufacturer Part: SC8701QDER; BOM_LCSC Assembly: Yes; spicePre: U; spiceSymbolName: SC8701QDER

## Nets that join several sheets
AGND: MCU copy (41 pins), power copy (37 pins), Switch1 copy (26 pins), Switch2 copy (26 pins)
VCAP: MCU copy (R19.2), power copy (XT3.1)
VCC-3.3: MCU copy (12 pins), power copy (5 pins), Switch1 copy (R31.1), Switch2 copy (R41.1)
VCC-5: MCU copy (C22.1 C23.1 U4.1 U6.3), power copy (16 pins)
VIN: MCU copy (R20.2), power copy (10 pins)
VOUT: MCU copy (R21.2), power copy (XT2.1)
NetC38_1: Switch1 copy (10 pins), Switch2 copy (9 pins)